# Altium schematic sheet SH3 - 5V BUCK CONVERTER.SchDoc: 5V Buck Converter
size B; CheckedBy: Cindy Li; Engineer: Farris Matar; Organization: UW Robotics; Address1: 200 University Avenue; Address2: Waterloo; Address3: Ontario; Address4: Canada N2L 3G6; DocumentNumber: 3; Revision: 3; SheetNumber: 3; SheetTotal: 9
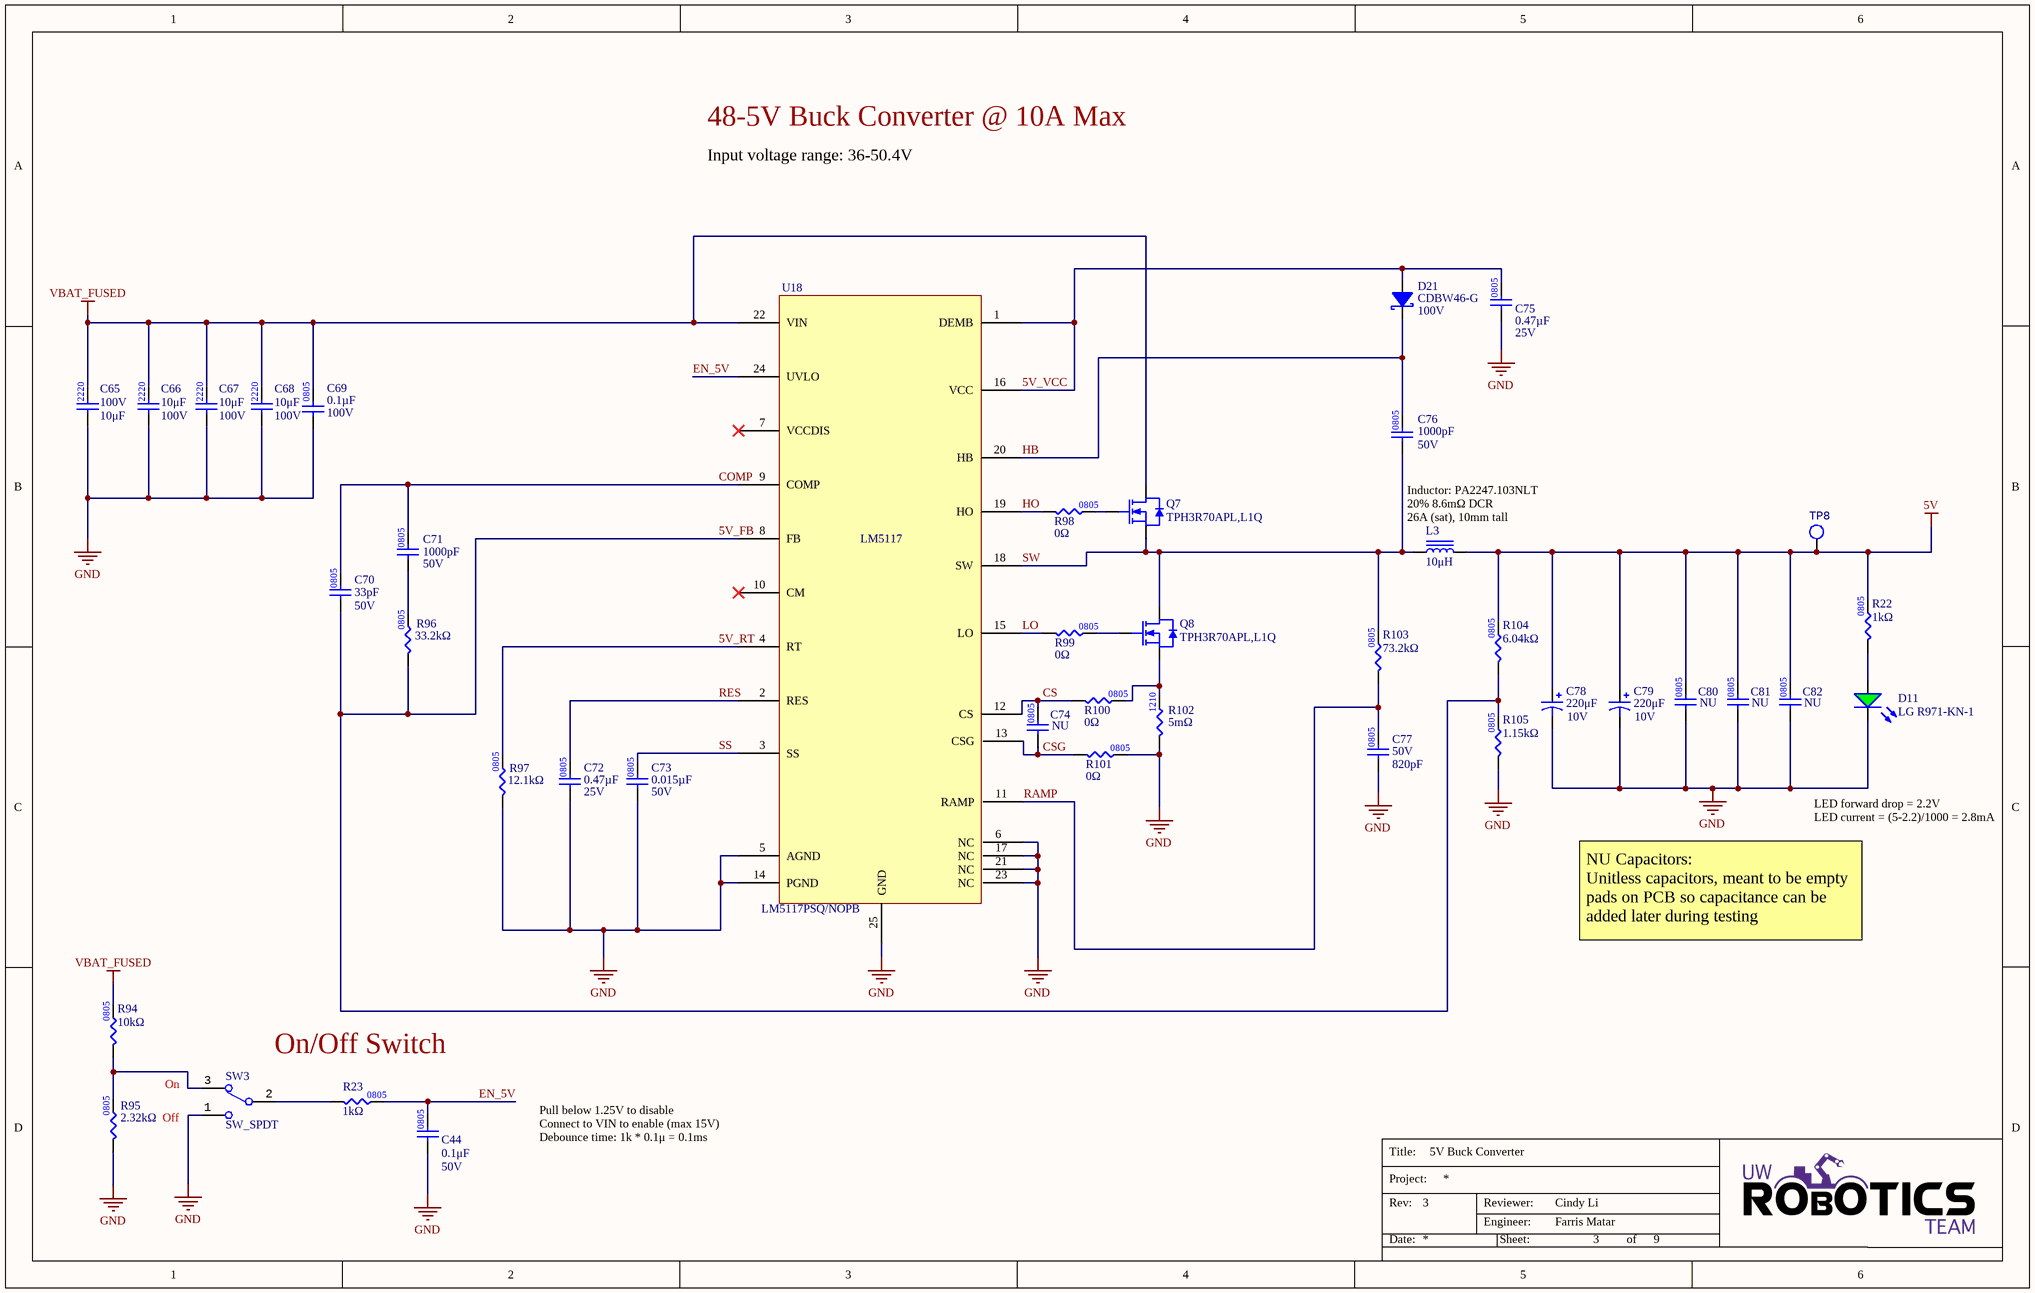
[diagram p0: SH3 - 5V BUCK CONVERTER.SchDoc]

## Parts
C44  value 0.1μF  Voltage Rating: 50V  [CAP2012]  (hidden comment: CAP_0.1uF_50V_0805)
C65  value 10μF  Voltage Rating: 100V  [CAP2220]  (hidden comment: CAP_10μF_100V_2220)
C66  value 10μF  Voltage Rating: 100V  [CAP2220]  (hidden comment: CAP_10μF_100V_2220)
C67  value 10μF  Voltage Rating: 100V  [CAP2220]  (hidden comment: CAP_10μF_100V_2220)
C68  value 10μF  Voltage Rating: 100V  [CAP2220]  (hidden comment: CAP_10μF_100V_2220)
C69  value 0.1µF  Voltage Rating: 100V  [CAP0805]  (hidden comment: CAP_0.1uF_100V_0805)
C70  value 33pF  Voltage Rating: 50V  [CAP0805]  (hidden comment: CAP_33pF_50V_0805)
C71  value 1000pF  Voltage Rating: 50V  [CAP2012]  (hidden comment: CAP_1000pF_50V_0805)
C72  value 0.47µF  Voltage Rating: 25V  [CAP0805]  (hidden comment: CAP_0.47uF_25V_0805)
C73  value 0.015µF  Voltage Rating: 50V  [CAP0805]  (hidden comment: CAP_0.015uF_50V_0805)
C74  value NU  [CAP0805]  (hidden comment: CAP_NU_0805)
C75  value 0.47µF  Voltage Rating: 25V  [CAP0805]  (hidden comment: CAP_0.47uF_25V_0805)
C76  value 1000pF  Voltage Rating: 50V  [CAP2012]  (hidden comment: CAP_1000pF_50V_0805)
C77  Voltage Rating: 50V  Capacitance: 820pF  [CAP0805]  (hidden comment: CAP_820pF_50V_0805)
C78  value 220μF  Voltage Rating: 10V  [CAP2917]  (hidden comment: CAP_220uF_10V_TANT)
C79  value 220μF  Voltage Rating: 10V  [CAP2917]  (hidden comment: CAP_220uF_10V_TANT)
C80  value NU  [CAP0805]  (hidden comment: CAP_NU_0805)
C81  value NU  [CAP0805]  (hidden comment: CAP_NU_0805)
C82  value NU  [CAP0805]  (hidden comment: CAP_NU_0805)
D11  Manufacturer Part Number 1: LG R971-KN-1  [LED_0805_GREEN]  (hidden comment: LED_GREEN)
D21  Manufacturer Part Number 1: CDBW46-G  Vr (Max): 100V  [SOD-123_FLAT]  (hidden comment: DIO_SCHOTTKY_100V_150mA)
L3  Inductance: 10μH  [IND_PULSE_PA2247]  (hidden comment: IND_10uH_24A)
Q7  Manufacturer Part Number 1: TPH3R70APL,L1Q  [8-SOP ADVANCE]  (hidden comment: NMOS_100V_90A)
Q8  Manufacturer Part Number 1: TPH3R70APL,L1Q  [8-SOP ADVANCE]  (hidden comment: NMOS_100V_90A)
R22  value 1kΩ  [RES0805]  (hidden comment: RES_1kΩ_0805_1%_1)
R23  value 1kΩ  [RES0805]  (hidden comment: RES_1kΩ_0805_1%)
R94  value 10kΩ  [RES0805]  (hidden comment: RES_10kΩ_0805_5%)
R95  value 2.32kΩ  [RES0805]  (hidden comment: RES_2.32kΩ_0805_1%)
R96  value 33.2kΩ  [RES0603]  (hidden comment: RES_33.2kΩ_0805_1%)
R97  value 12.1kΩ  [RES0805]  (hidden comment: RES_12.1kΩ_0805_1%)
R98  value 0Ω  [RES0805]  (hidden comment: RES_0Ω_0805)
R99  value 0Ω  [RES0805]  (hidden comment: RES_0Ω_0805)
R100  value 0Ω  [RES0805]  (hidden comment: RES_0Ω_0805)
R101  value 0Ω  [RES0805]  (hidden comment: RES_0Ω_0805)
R102  value 5mΩ  [RES1210]  (hidden comment: RES_5mΩ_1210_1%)
R103  value 73.2kΩ  [RES0603]  (hidden comment: RES_73.2kΩ_0805_1%)
R104  value 6.04kΩ  [RES0805]  (hidden comment: RES_6.04kΩ_0805_1%)
R105  value 1.15kΩ  [RES0805]  (hidden comment: RES_1.15kΩ_0805_1%)
SW3  SW_SPDT  [100SP1T1B4M2QE]
TP8  TESTPOINT_LOOP  [TESTPOINT_LOOP]  (value not drawn)
U18  Manufacturer Part Number 1: LM5117PSQ/NOPB  [24-WQFN]  (hidden comment: BUCK_LM5117QFN)

## Nets
5V: C78.1 C79.1 C80.2 C81.2 C82.2 L3.2 R22.2 R104.2 TP8.1
GND: C44.1 C65.1 C66.1 C67.1 C68.1 C69.1 C72.1 C73.1 C75.1 C77.1 C78.2 C79.2 C80.1 C81.1 C82.1 D11.2(K) R95.1 R97.1 R101.2 R102.1 R105.1 SW3.1 U18.5(AGND) U18.6(NC) U18.14(PGND) U18.17(NC) U18.21(NC) U18.23(NC) U18.25(GND)
VBAT_FUSED: C65.2 C66.2 C67.2 C68.2 C69.2 Q7.3(Drain) R94.2 U18.22(VIN)
5V_FB: C70.1 R96.1 R104.1 R105.2 U18.8(FB)
5V_RT: R97.2 U18.4(RT)
5V_VCC: C75.2 D21.2(Anode) U18.1(DEMB) U18.16(VCC)
COMP: C70.2 C71.2 U18.9(COMP)
CS: C74.2 R100.1 U18.12(CS)
CSG: C74.1 R101.1 U18.13(CSG)
EN_5V: C44.2 R23.2 U18.24(UVLO)
HB: C76.2 D21.1(Cathode) U18.20(HB)
HO: R98.1 U18.19(HO)
LO: R99.1 U18.15(LO)
RAMP: C77.2 R103.1 U18.11(RAMP)
RES: C72.2 U18.2(RES)
SS: C73.2 U18.3(SS)
SW: C76.1 L3.1 Q7.2(Source) Q8.3(Drain) R103.2 U18.18(SW)
NetC71_1: C71.1 R96.2
NetD11_1: D11.1(A) R22.1
NetQ7_1: Q7.1(Gate) R98.2
NetQ8_1: Q8.1(Gate) R99.2
NetQ8_2: Q8.2(Source) R100.2 R102.2
NetR23_1: R23.1 SW3.2
NetR94_1: R94.1 R95.2 SW3.3

Not connected (* = marked no-connect by the designer): U18 7(VCCDIS)* 10(CM)*

## Notes on the sheet
- 48-5V Buck Converter @ 10A Max
- Input voltage range: 36-50.4V
- Inductor: PA2247.103NLT
- 20% 8.6mΩ DCR
- (near L3) 26A (sat), 10mm tall
- LED forward drop = 2.2V
  LED current = (5-2.2)/1000 = 2.8mA
- NU Capacitors:
  Unitless capacitors, meant to be empty
  pads on PCB so capacitance can be
  added later during testing
- On
- On/Off Switch
- Off
- Pull below 1.25V to disable
  Connect to VIN to enable (max 15V)
  Debounce time: 1k * 0.1μ = 0.1ms
- Title:
- Project:
- Date:
- Rev:
- Reviewer:
- Engineer:
- Sheet:
- of
- (in symbol BUCK_LM5117QFN) LM5117

## Library data of the parts
C44 = CAP_0.1uF_50V_0805: CAP CER 0.1UF 50V X7R 0805; Manufacturer Part Number 1: GCM21BR71H104KA37K; Manufacturer 1: Murata Electronics; Package/Footprint: 0805; Supplier Part Number 1: 490-8049-1-ND; Supplier 1: Digi-Key; Dielectric: X7R; LCSC Part #: C49678; Mounting Type: SMD
C65-C68 = CAP_10μF_100V_2220: CAP CER 10UF 100V X7S 2220; Manufacturer 1: TDK Corporation; Manufacturer Part Number 1: CGA9N3X7S2A106K230KE; Mounting Type: SMD; Supplier 1: Digi-Key; Supplier Part Number 1: 445-8768-1-ND; Package: 2220
C69 = CAP_0.1uF_100V_0805: CAP CER 0.1UF 100V X7R 0805; Manufacturer 1: TDK Corporation; Manufacturer Part Number 1: C2012X7R2A104K125AA; Supplier 1: Digi-Key; Supplier Part Number 1: 445-1418-1-ND; Package: 0805
C70 = CAP_33pF_50V_0805: CAP CER 33PF 50V C0G/NP0 0805; Manufacturer 1: Samsung Electro-Mechanics; Manufacturer Part Number 1: CL21C330JBANNNC; Supplier 1: Digi-Key; Supplier Part Number 1: 1276-1105-1-ND; Dielectric: C0G/NP0; Mounting Type: SMD; Package: 0805
C71 C76 = CAP_1000pF_50V_0805: CAP CER 1000pF 50V X7R 0805; Manufacturer 1: Samsung; Manufacturer Part Number 1: CL21B102KBANNNC; Package/Footprint: 0805; Supplier 1: Digi-Key; Supplier Part Number 1: 1276-1020-1-ND; Mounting Type: SMD; Dielectric: X7R
C72 C75 = CAP_0.47uF_25V_0805: CAP CER 0.47UF 25V X5R 0805; Manufacturer 1: KEMET; Manufacturer Part Number 1: C0805C474K3PAC7800; Supplier 1: Digi-Key; Supplier Part Number 1: 399-15508-1-ND; Package: 0805
C73 = CAP_0.015uF_50V_0805: CAP CER 0.015UF 50V C0G 0805; Manufacturer 1: TDK Corporation; Manufacturer Part Number 1: CGA4F2C0G1H153J085AA; Supplier 1: Digi-Key; Supplier Part Number 1: 445-6948-1-ND; Package: 0805
C74 C80-C82 = CAP_NU_0805: PLACEHOLDER CAPACITOR; Mounting Type: SMD; Package: 0805
C77 = CAP_820pF_50V_0805: CAP CER 820PF 50V C0G/NP0 0805; Manufacturer 1: KEMET; Manufacturer Part Number 1: C0805X821J5GAC7800; Package/Footprint: 0805; Supplier 1: Digi-Key; Supplier Part Number 1: 399-19481-1-ND
C78 C79 = CAP_220uF_10V_TANT: CAP TANT POLY 220UF 10V 2917; Manufacturer 1: Vishay Sprague; Manufacturer Part Number 1: T55D227M010C0008; Supplier 1: Digi-Key; Supplier Part Number 1: 718-2303-1-ND
D11 = LED_GREEN: LED GREEN DIFFUSED 0805 SMD; Manufacturer 1: OSRAM; Forward Voltage Drop: 2.2V; Package/Footprint: 0805; Supplier Part Number 1: 475-1410-1-ND; Supplier 1: Digi-Key; Mounting Type: SMD
D21 = DIO_SCHOTTKY_100V_150mA: DIODE SCHOTTKY 100V 150MA SOD123; Manufacturer 1: Comchip Technology; Package/Footprint: SOD-123; Mounting Type: SMD; Supplier 1: Digi-Key; Supplier Part Number 1: 641-1964-1-ND
L3 = IND_10uH_24A: FIXED IND 10UH 24A 8.6 MOHM SMD; Manufacturer 1: Pulse Electronics Power; Manufacturer Part Number 1: PA2247.103NLT; DC Resistance (DCR): 8.6mR; Saturation Current: 26A; Current Rating: 24A; Supplier 1: Digi-Key; Supplier Part Number 1: 553-PA2247.103NLTCT-ND
Q7 Q8 = NMOS_100V_90A: MOSFET N-CH 100V 90A 8SOP; Manufacturer 1: Toshiba Semiconductor and Storage; Vgs (Max): ±20V; Supplier 1: Digi-Key; Supplier Part Number 1: 264-TPH3R70APLL1QCT-ND; Vdss: 100V; Package/Footprint: 8-SOP Advance; Id: 90A
R22 = RES_1kΩ_0805_1%_1: RES 1K OHM 1% 1/8W 0805; Manufacturer 1: Yageo; Manufacturer Part Number 1: RC0805FR-071KL; Supplier 1: Digi-Key; Mounting Type: SMD; Supplier Part Number 1: 311-1.00KCRCT-ND; LCSC Part #: C17513; Package: 0805
R23 = RES_1kΩ_0805_1%: RES 1K OHM 1% 1/8W 0805; Manufacturer 1: Yageo; Manufacturer Part Number 1: RC0805FR-071KL; Supplier Part Number 1: 311-1.00KCRCT-ND; Supplier 1: Digi-Key; Mounting Type: SMD; LCSC Part #: C17513; Package: 0805
R94 = RES_10kΩ_0805_5%: RES 10K OHM 5% 1/8W 0805; Manufacturer 1: Panasonic Electronic Components; Manufacturer Part Number 1: ERJ-6GEYJ103V; Package/Footprint: 0805; Supplier 1: Digi-Key; Supplier Part Number 1: P10KACT-ND; LCSC Part #: C17414; Mounting Type: SMD
R95 = RES_2.32kΩ_0805_1%: RES 2.32K OHM 1% 1/4W 0805; Manufacturer 1: Stackpole Electronics Inc; Manufacturer Part Number 1: RNCP0805FTD2K32; Supplier 1: Digi-Key; Supplier Part Number 1: RNCP0805FTD2K32CT-ND; Package: 0805
R96 = RES_33.2kΩ_0805_1%: RES 33.2K OHM 1% 1/8W 0805; Manufacturer 1: Stackpole Electronics Inc; Manufacturer Part Number 1: RMCF0805FT33K2; Package/Footprint: 0805; Supplier 1: Digi-Key; Supplier Part Number 1: RMCF0805FT33K2CT-ND; Mounting Type: SMD
R97 = RES_12.1kΩ_0805_1%: RES 12.1K OHM 1% 1/4W 0805; Manufacturer 1: Stackpole Electronics Inc; Manufacturer Part Number 1: RNCP0805FTD12K1; Supplier 1: Digi-Key; Supplier Part Number 1: RNCP0805FTD12K1CT-ND; Package: 0805
R98-R101 = RES_0Ω_0805: RES 0 OHM JUMPER 1/8W 0805; Manufacturer 1: Panasonic Electronic Components; Manufacturer Part Number 1: ERJ-6GEY0R00V; Package/Footprint: 0805; Supplier Part Number 1: P0.0ACT-ND; Supplier 1: Digi-Key; Mounting Type: SMD; LCSC Part #: C17477
R102 = RES_5mΩ_1210_1%: RES 0.005 OHM 1% 1W 1210; Manufacturer 1: Rohm Semiconductor; Manufacturer Part Number 1: PMR25HZPFU5L00; Package/Footprint: 1210; Supplier 1: Digi-Key; Supplier Part Number 1: RHM.005APCT-ND; Mounting Type: SMD
R103 = RES_73.2kΩ_0805_1%: RES 73.2K OHM 1% 1/8W 0805; Manufacturer 1: Yageo; Manufacturer Part Number 1: RC0805FR-0773K2L; Package/Footprint: 0805; Mounting Type: SMD; Supplier 1: Digi-Key; Supplier Part Number 1: 311-73.2KCRCT-ND
R104 = RES_6.04kΩ_0805_1%: RES 6.04K OHM 1% 1/8W 0805; Manufacturer 1: Yageo; Manufacturer Part Number 1: RC0805FR-076K04L; Package/Footprint: 0805; Supplier 1: Digi-Key; Supplier Part Number 1: 311-6.04KCRCT-ND; Mounting Type: SMD
R105 = RES_1.15kΩ_0805_1%: RES 1.15K OHM 1% 1/8W 0805; Manufacturer 1: Yageo; Manufacturer Part Number 1: RC0805FR-071K15L; Package/Footprint: 0805; Supplier 1: Digi-Key; Supplier Part Number 1: 311-1.15KCRCT-ND; Mounting Type: SMD
SW3 = SW_SPDT: SWITCH TOGGLE SPDT 5A 120V; Manufacturer 1: E-Switch; Voltage Rating (DC): 28V; Package/Footprint: TH; Supplier 1: Digi-Key; Manufacturer Part Number 1: 100SP1T1B4M2QE; Throw Configuration: SPDT; Supplier Part Number 1: EG2355-ND; Current Rating: 5A; Mounting Type: TH
TP8 = TESTPOINT_LOOP: TESTPOINT THRUHOLE; Manufacturer 1: Keystone Electronics; Manufacturer Part Number 1: 5002; Package/Footprint: TH; Supplier Part Number 1: 36-5002-ND; Supplier 1: Digi-Key; Mounting Type: TH
U18 = BUCK_LM5117QFN: IC REG CTRLR BUCK 24WQFN; Manufacturer 1: Texas Instruments; Mounting Type: SMD; Package/Footprint: 24-WQFN; Supplier 1: Mouser; Supplier Part Number 1: 595-LM5117PSQE/NOPB